# Altium schematic sheet VFD-Clock.SchDoc
size A3
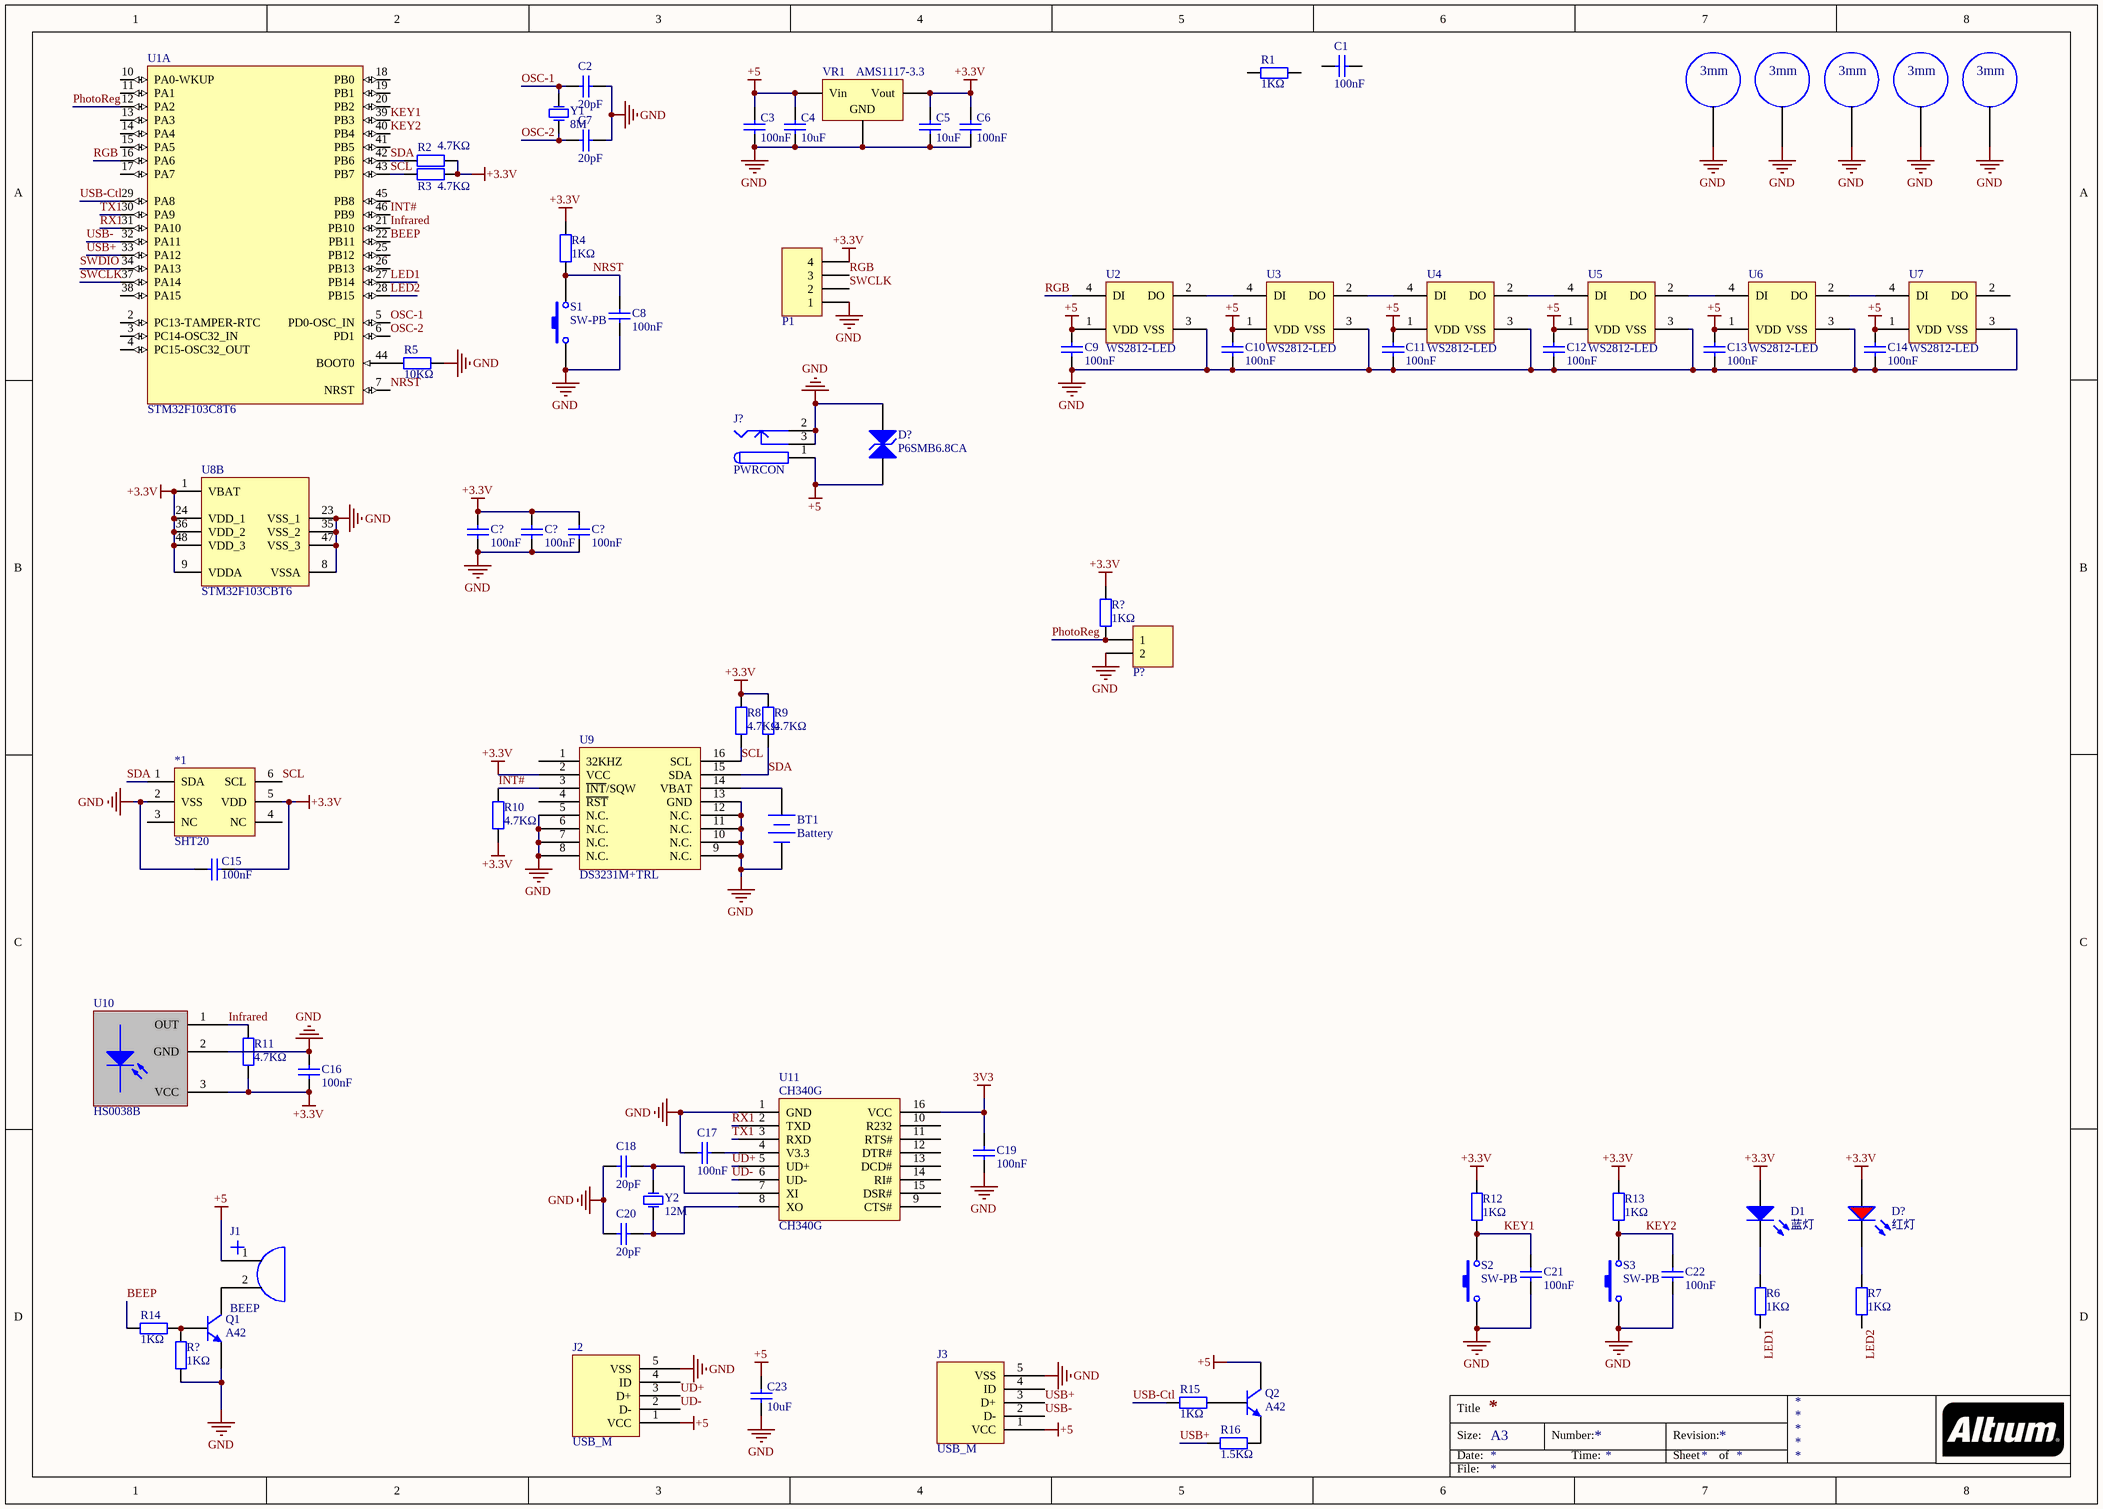
[diagram p0: VFD-Clock.SchDoc]

## Parts
(Parts that share a designator on the sheet are numbered #1, #2 ... from top to bottom, then left to right.)
*1  SHT20  [DFN6]
BT1  Battery  [CR1220]
C1  100nF  [0805_C]
C2  20pF  [0805_C]
C3  100nF  [0805_C]
C4  10uF  [0805_C]
C5  10uF  [0805_C]
C6  100nF  [0805_C]
C7  20pF  [0805_C]
C8  100nF  [0805_C]
C9  100nF  [0805_C]
C10  100nF  [0805_C]
C11  100nF  [0805_C]
C12  100nF  [0805_C]
C13  100nF  [0805_C]
C14  100nF  [0805_C]
C15  100nF  [0805_C]
C16  100nF  [0805_C]
C17  100nF  [0805_C]
C18  20pF  [0805_C]
C19  100nF  [0805_C]
C20  20pF  [0805_C]
C21  100nF  [0805_C]
C22  100nF  [0805_C]
C23  10uF  [0805_C]
C?#1  100nF  [0805_C]
C?#2  100nF  [0805_C]
C?#3  100nF  [0805_C]
D1  蓝灯  [0805_LED_S1]
D?#1  P6SMB6.8CA  [SMB(DO-214AA)_S1]
D?#2  红灯  [0805_LED_S1]
J1  BEEP  [Beep]
J2  USB_M  [USB_MICRO]
J3  USB_M  [USB_MICRO]
J?  PWRCON  [DC-005]
P1  Header 4  [HDR4X1_A]  (value not drawn)
P?  Header 2  [HDR2X1_B1]  (value not drawn)
Q1  A42  [SOT-23(SOT-23-3)]
Q2  A42  [SOT-23(SOT-23-3)]
R1  1KΩ  [0805_R]
R2  4.7KΩ  [0805_R]
R3  4.7KΩ  [0805_R]
R4  1KΩ  [0805_R]
R5  10KΩ  [0805_R]
R6  1KΩ  [0805_R]
R7  1KΩ  [0805_R]
R8  4.7KΩ  [0805_R]
R9  4.7KΩ  [0805_R]
R10  4.7KΩ  [0805_R]
R11  4.7KΩ  [0805_R]
R12  1KΩ  [0805_R]
R13  1KΩ  [0805_R]
R14  1KΩ  [0805_R]
R15  1KΩ  [0805_R]
R16  1.5KΩ  [0805_R]
R?#1  1KΩ  [0805_R]
R?#2  1KΩ  [0805_R]
S1  SW-PB  [SW_PB2_A1]
S2  SW-PB  [SW_PB2_A1]
S3  SW-PB  [SW_PB2_A1]
T1  M3铜柱螺丝孔  [螺丝孔-3mm]  (value not drawn)
T2  M3铜柱螺丝孔  [螺丝孔-3mm]  (value not drawn)
T3  M3铜柱螺丝孔  [螺丝孔-3mm]  (value not drawn)
T4  M3铜柱螺丝孔  [螺丝孔-3mm]  (value not drawn)
T5  M3铜柱螺丝孔  [螺丝孔-3mm]  (value not drawn)
U1  STM32F103C8T6  [LQFP-48_7x7x05P]  (part A of 2)
U2  WS2812-LED  [WS2812]
U3  WS2812-LED  [WS2812]
U4  WS2812-LED  [WS2812]
U5  WS2812-LED  [WS2812]
U6  WS2812-LED  [WS2812]
U7  WS2812-LED  [WS2812]
U8  STM32F103CBT6  [LQFP-48_7x7x05P]  (part B of 2)
U9  DS3231M+TRL  [LC-SOIC-16_300mil]
U10  HS0038B  [HS0038B]
U11  CH340G  [LC-SOIC-16_150mil]
VR1  AMS1117-3.3  [SOT-223]
Y1  8M  [X-SM49]
Y2  12M  [X-SM49]

## Nets
3V3: C19.2 U11.16(VCC)
+3.3V: *1.5(VDD) C5.2 C6.2 C15.2 C16.1 C?#1.2 C?#2.2 C?#3.2 D1.A D?#2.A P1.4 R2.2 R3.2 R4.2 R8.2 R9.2 R10.1 R11.1 R12.2 R13.2 R?#1.2 U8.1(VBAT) U8.9(VDDA) U8.24(VDD_1) U8.36(VDD_2) U8.48(VDD_3) U9.2(VCC) U10.3(VCC) VR1.2(Vout)
+5: C3.2 C4.2 C9.2 C10.2 C11.2 C12.2 C13.2 C14.2 C23.2 D?#1.1(A) J1.1 J2.1(VCC) J3.1(VCC) J?.1 Q2.3(C) U2.1(VDD) U3.1(VDD) U4.1(VDD) U5.1(VDD) U6.1(VDD) U7.1(VDD) VR1.3(Vin)
GND: *1.2(VSS) BT1.2(-) C2.2 C3.1 C4.1 C5.1 C6.1 C7.2 C8.1 C9.1 C10.1 C11.1 C12.1 C13.1 C14.1 C15.1 C16.2 C17.1 C18.1 C19.1 C20.1 C21.1 C22.1 C23.1 C?#1.1 C?#2.1 C?#3.1 D?#1.2(K) J2.5(VSS) J3.5(VSS) J?.2 J?.3 P1.1 P?.2 Q1.2(E) R5.1 R?#2.1 S1.1 S2.1 S3.1 T1.1 T2.1 T3.1 T4.1 T5.1 U2.3(VSS) U3.3(VSS) U4.3(VSS) U5.3(VSS) U6.3(VSS) U7.3(VSS) U8.8(VSSA) U8.23(VSS_1) U8.35(VSS_2) U8.47(VSS_3) U9.5(N.C.) U9.6(N.C.) U9.7(N.C.) U9.8(N.C.) U9.9(N.C.) U9.10(N.C.) U9.11(N.C.) U9.12(N.C.) U9.13(GND) U10.2(GND) U11.1(GND) VR1.1(GND)
BEEP: R14.1 U1.22(PB11)
Infrared: R11.2 U1.21(PB10) U10.1(OUT)
INT#: R10.2 U1.46(PB9) U9.3(~{INT}/SQW)
KEY1: C21.2 R12.1 S2.2 U1.39(PB3)
KEY2: C22.2 R13.1 S3.2 U1.40(PB4)
LED1: R6.2 U1.27(PB14)
LED2: R7.2 U1.28(PB15)
NRST: C8.2 R4.1 S1.2 U1.7(NRST)
OSC-1: C2.1 U1.5(PD0-OSC_IN) Y1.1(OSC1)
OSC-2: C7.1 U1.6(PD1) Y1.2(OSC2)
PhotoReg: P?.1 R?#1.1 U1.12(PA2)
RGB: P1.3 U1.16(PA6) U2.4(DI)
RX1: U1.31(PA10) U11.2(TXD)
SCL: *1.6(SCL) R3.1 R8.1 U1.43(PB7) U9.16(SCL)
SDA: *1.1(SDA) R2.1 R9.1 U1.42(PB6) U9.15(SDA)
SWCLK: P1.2 U1.37(PA14)
SWDIO: U1.34(PA13)
TX1: U1.30(PA9) U11.3(RXD)
UD+: J2.3(D+) U11.5(UD+)
UD-: J2.2(D-) U11.6(UD-)
USB+: J3.3(D+) R16.2 U1.33(PA12)
USB-: J3.2(D-) U1.32(PA11)
USB-Ctl: R15.1 U1.29(PA8)
NetBT1_1: BT1.1(+) U9.14(VBAT)
NetC17_2: C17.2 U11.4(V3.3)
NetC18_2: C18.2 U11.7(XI) Y2.1(OSC1)
NetC20_2: C20.2 U11.8(XO) Y2.2(OSC2)
NetD1_K: D1.K R6.1
NetD?#2_K: D?#2.K R7.1
NetJ1_2: J1.2 Q1.3(C)
NetQ1_1: Q1.1(B) R14.2 R?#2.2
NetQ2_1: Q2.1(B) R15.2
NetQ2_2: Q2.2(E) R16.1
NetR5_2: R5.2 U1.44(BOOT0)
NetU2_2: U2.2(DO) U3.4(DI)
NetU3_2: U3.2(DO) U4.4(DI)
NetU4_2: U4.2(DO) U5.4(DI)
NetU5_2: U5.2(DO) U6.4(DI)
NetU6_2: U6.2(DO) U7.4(DI)

Not connected (* = marked no-connect by the designer): *1 3(NC) 4(NC); C1 1 2; J2 4(ID); J3 4(ID); R1 1 2; U1 2(PC13-TAMPER-RTC) 3(PC14-OSC32_IN) 4(PC15-OSC32_OUT) 10(PA0-WKUP) 11(PA1) 13(PA3) 14(PA4) 15(PA5) 17(PA7) 18(PB0) 19(PB1) 20(PB2) 25(PB12) 26(PB13) 38(PA15) 41(PB5) 45(PB8); U7 2(DO); U9 1(32KHZ) 4(~{RST}); U11 9(CTS#) 10(R232) 11(RTS#) 12(DTR#) 13(DCD#) 14(RI#) 15(DSR#)

## Notes on the sheet
- Title
- Size:
- Date:
- A3
- Number:
- Time:
- Revision:
- Sheet
- of
- File:
- (in symbol M3铜柱螺丝孔) 3mm

## Library data of the parts
*1 = SHT20: 温湿度传感器
BT1 = Battery: 备份电池; Published: 24-Mar-1999; LatestRevisionDate: 17-Jul-2002; LatestRevisionNote: Re-released for DXP Platform.; PackageReference: BAT-2; Publisher: Altium Limited
C1 C3 C6 C8-C17 C19 C21 C22 C?#1-C?#3 = 0805 100nF(104) 10% 50V: 贴片电容; ComponentLink1Description: 供应商链接; ComponentLink1URL: http://www.szlcsc.com/product/details_50686.html; Package: 0805; Supplier: LC; SuppliersPartNumber: C49678
C2 C7 C18 C20 = 0805 20pF (200) 5% 50V: 贴片电容; ComponentLink1Description: 供应商链接; ComponentLink1URL: http://www.szlcsc.com/product/details_2150.html; Package: 0805; Supplier: LC; SuppliersPartNumber: C1798
C4 C5 C23 = 0805 10uF (106) 10% 25V: 贴片电容; ComponentLink1Description: 供应商链接; ComponentLink1URL: http://www.szlcsc.com/product/details_16532.html; Package: 0805; Supplier: LC; SuppliersPartNumber: C15850
D1 = 0805 蓝灯: 发光二极管; ComponentLink1Description: 供应商链接; ComponentLink1URL: http://www.szlcsc.com/product/details_2666.html; Package: 0805; Supplier: LC; SuppliersPartNumber: C2293
D?#1 = SMB/DO-214AA P6SMB6.8CA: TVS; ComponentLink1Description: 供应商链接; ComponentLink1URL: http://www.szlcsc.com/product/details_79530.html; Package: SMB/DO-214AA; Supplier: LC; SuppliersPartNumber: C78395
D?#2 = 0805 红灯: 发光二极管; ComponentLink1Description: 供应商链接; ComponentLink1URL: http://www.szlcsc.com/product/details_2668.html; Package: 0805; Supplier: LC; SuppliersPartNumber: C2295
J1 = BEEP: 蜂鸣器
J2 J3 = USB_M: MicroUSB接口
J? = PWRCON: 直流电源端子插座; Published: 17-Dec-2003; DatasheetDocument: 09-May-2002; Publisher: Altium Limited; ComponentLink1Description: Manufacturer Link; ComponentLink1URL: http://domino.kycon.com/internet/Products.html
P1 = Header 4: 接插件; LatestRevisionDate: 17-Jul-2002; LatestRevisionNote: Re-released for DXP Platform.; Publisher: Altium Limited
P? = Header 2: 接插件; LatestRevisionDate: 17-Jul-2002; LatestRevisionNote: Re-released for DXP Platform.; Publisher: Altium Limited
Q1 Q2 = SOT-23 SS8050 Y1: 三极管; ComponentLink1Description: 供应商链接; ComponentLink1URL: http://www.szlcsc.com/product/details_2507.html; Package: SOT-23; Supplier: LC; SuppliersPartNumber: C2150
R1 R4 R6 R7 R12-R15 R?#1 R?#2 = 0805 1KΩ (1001) 1%: 贴片电阻; ComponentLink1Description: 供应商链接; ComponentLink1URL: http://www.szlcsc.com/product/details_18201.html; Package: 0805; Supplier: LC; SuppliersPartNumber: C17513
R2 R3 R8-R11 = 0805 4.7KΩ (4701) 1%: 贴片电阻; ComponentLink1Description: 供应商链接; ComponentLink1URL: http://www.szlcsc.com/product/details_18361.html; Package: 0805; Supplier: LC; SuppliersPartNumber: C17673
R5 = 0805 10KΩ (1002) 1%: 贴片电阻; ComponentLink1Description: 供应商链接; ComponentLink1URL: http://www.szlcsc.com/product/details_18102.html; Package: 0805; Supplier: LC; SuppliersPartNumber: C17414
R16 = 0805 1.5KΩ (1501) 1%: 贴片电阻; ComponentLink1Description: 供应商链接; ComponentLink1URL: http://www.szlcsc.com/product/details_4717.html; Package: 0805; Supplier: LC; SuppliersPartNumber: C4310
S1-S3 = SW-PB: 微动开关; Published: 24-Mar-1999; LatestRevisionDate: 17-Jul-2002; LatestRevisionNote: Re-released for DXP Platform.; PackageReference: SPST-2; Publisher: Altium Limited
U1 = STM32F103C8T6: ARM; ComponentLink1Description: 供应商链接; ComponentLink1URL: http://www.szlcsc.com/product/details_9243.html; Package: LQFP-48_7x7x05P; Supplier: LC; SuppliersPartNumber: C8734
U8 = STM32F103CBT6: ARM; ComponentLink1Description: 供应商链接; ComponentLink1URL: http://www.szlcsc.com/product/details_8796.html; Package: LQFP-48_7x7x05P; Supplier: LC; SuppliersPartNumber: C8304
U9 = DS3231M+TRL: 实时时钟; ComponentLink1Description: 供应商链接; ComponentLink1URL: http://www.szlcsc.com/product/details_38643.html; Package: SOIC-16_300mil; Supplier: LC; SuppliersPartNumber: C37663
U10 = HS0038B: 红外接收器
U11 = CH340G: USB; ComponentLink1Description: 供应商链接; ComponentLink1URL: http://www.szlcsc.com/product/details_14927.html; Package: SOIC-16_150mil; Supplier: LC; SuppliersPartNumber: C14267
VR1 = SOT-223 AMS1117-3.3: 低压差线性稳压(LDO); ComponentLink1Description: 供应商链接; ComponentLink1URL: http://www.szlcsc.com/product/details_6652.html; Package: SOT-223; Supplier: LC; SuppliersPartNumber: C6186
Y1 Y2 = XTAL: 晶振; Published: 8-Jun-2000; LatestRevisionDate: 17-Jul-2002; LatestRevisionNote: Re-released for DXP Platform.; PackageReference: R38; Publisher: Altium Limited